# EAGLE design PS (EAGLE 6.5.0)
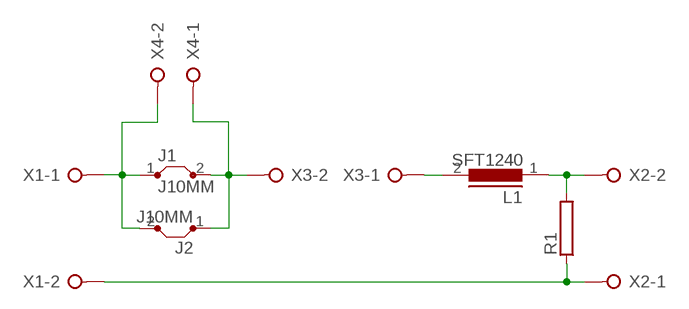
[diagram p0: schematic, sheet 1]

## Parts
J1  J10MM  [10]
J2  J10MM  [10]
L1  SFT1240  [SFT1240]
R1  RAC04  [AC04]
X1  W237-02P  [W237-132]
X2  W237-02P  [W237-132]
X3  W237-02P  [W237-132]
X4  W237-02P  [W237-132]

## Nets
GND: R1.1 X1.2 X2.1
N$3: J1.2 J2.1 X3.2 X4.1
VCAPS: L1.2 X3.1
VIN: J1.1 J2.2 X1.1 X4.2
VOUT: L1.1 R1.2 X2.2

## Library data of the parts
J1 J2 = jumper:J: Bridge
L1 = inductors:SFT1240: INDUCTOR
R1 = resistor-power:R: Power Resitor; OC_FARNELL: unknown; OC_NEWARK: unknown
X1-X4 = con-wago-508:W237-02P: WAGO SREW CLAMP; OC_FARNELL: unknown; OC_NEWARK: unknown

## Board
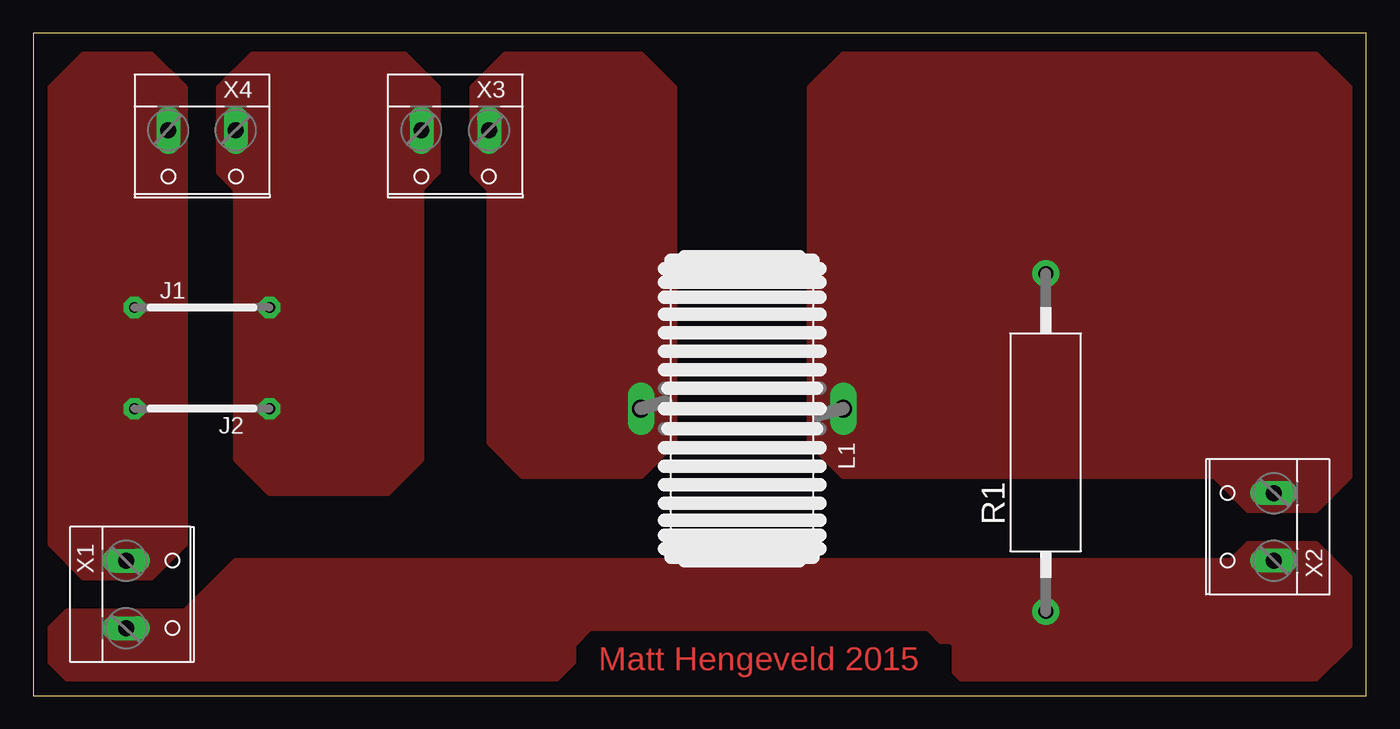
[diagram p1: board, top side]

Size 100.31 x 49.84 mm. Coordinates in mm from the lower left corner, seen from the top.
Outline: 0,0 100.31,0 100.31,49.84 0,49.84 0,0
Copper layers (1*16): Top 0.035mm / dielectric 1.5mm / Bottom 0.035mm
Design rules "default": minimum track width 10mil, minimum drill 24mil, track to track 8mil, track to pad 8mil, pad to pad 8mil, via to via 8mil, smd to smd 8mil, copper to edge 40mil, drill to drill 8mil, minimum pad ring 10mil, minimum via ring 8mil, stop-mask expansion 4mil, vias tented up to drill 0mil, thermal gap 10mil

### Footprints (pad centres in the part's own frame; a part is rotated, then mirrored left to right if it is on the bottom)
10 = drill 0.813 pad 1.6 octagon: 1 -5.08,0; 2 5.08,0
SFT1240 = drill 1.321 long: 1 -7.62,0; 2 7.62,0
AC04 = drill 1.1 pad 2: 1 -12.7,0; 2 12.7,0
W237-132 = drill 1.194 long: 1 -2.54,-0.635; 2 2.54,-0.635

### Placement (x,y rotation side)
J1  12.7,29.21 0 top
J2  12.7,21.59 180 top
L1  53.34,21.59 180 top
R1  76.2,19.05 90 top
X1  7.62,7.62 270 top
X2  92.71,12.7 90 top
X3  31.75,41.91 180 top
X4  12.7,41.91 180 top

### Tracks (layer width: path | path; a pad name or v marks a point on that pad's centre or on a via)
GND
  pour Top (no thermals): 2.54,6.35 1.27,5.08 1.27,2.54 2.54,1.27 39.37,1.27 40.64,2.54 40.64,3.81 41.91,5.08 67.31,5.08 68.58,3.81 68.58,2.54 69.85,1.27 96.52,1.27 99.06,3.81 99.06,8.89 96.52,11.43 91.44,11.43 90.17,10.16 15.24,10.16 11.43,6.35
N$3
  pour Top (isolate 1.016, no thermals): 27.94,48.26 16.51,48.26 13.97,45.72 13.97,39.37 15.24,38.1 15.24,17.78 17.78,15.24 26.67,15.24 29.21,17.78 29.21,38.1 30.48,39.37 30.48,45.72
VCAPS
  pour Top (isolate 1.016, no thermals): 35.56,48.26 33.02,45.72 33.02,39.37 34.29,38.1 34.29,19.05 36.83,16.51 45.72,16.51 48.26,19.05 48.26,45.72 45.72,48.26
VIN
  pour Top (no thermals): 11.43,45.72 8.89,48.26 3.81,48.26 1.27,45.72 1.27,11.43 3.81,8.89 8.89,8.89 11.43,11.43
VOUT
  pour Top (no thermals): 60.96,16.51 58.42,19.05 58.42,45.72 60.96,48.26 96.52,48.26 99.06,45.72 99.06,16.51 96.52,13.97 91.44,13.97 88.9,16.51

### Text on the board
Top: Matt Hengeveld 2015